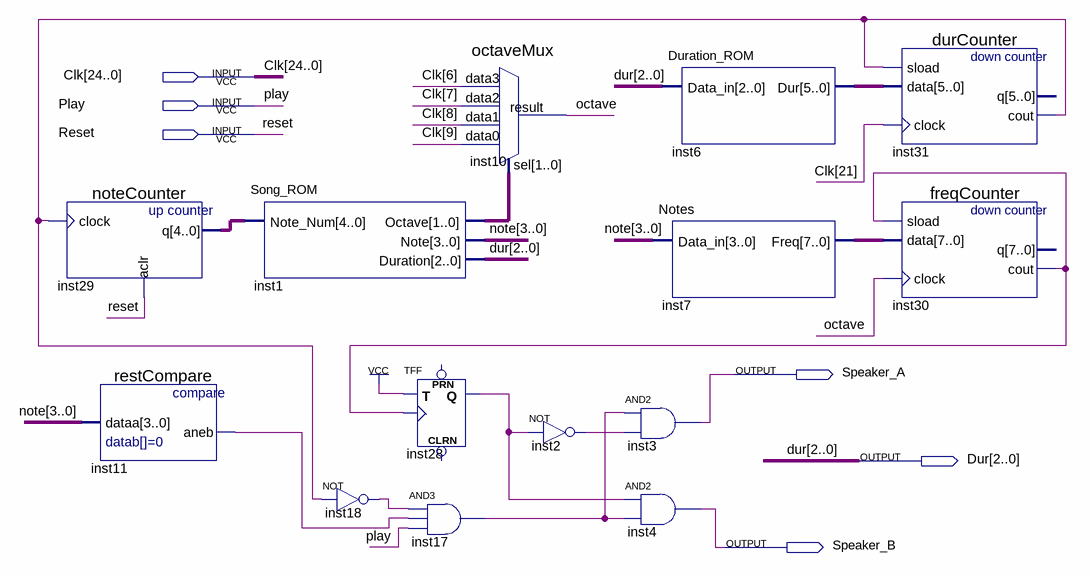
[diagram p0: schematic sheet]
// Quartus schematic Music_Block.bdf as structural Verilog: 14 symbols, 6 pins
module Music_Block (
  input  [24:0] Clk,
  input  Play,
  input  Reset,
  output Speaker_A,
  output [2:0] Dur,
  output Speaker_B
);

  wire inst2_out, inst11_aneb, inst17_out, inst18_out, inst28_q, inst30_cout, inst31_cout, octave;
  wire [1:0] inst1_octave;
  wire [3:0] note;
  wire [4:0] inst29_q;
  wire [5:0] inst6_dur;
  wire [7:0] inst7_freq;

  noteCounter inst29 (.clock(inst31_cout), .aclr(Reset), .q(inst29_q));
  restCompare inst11 (.dataa(note), .aneb(inst11_aneb));
  Song_ROM inst1 (.Note_Num(inst29_q), .Octave(inst1_octave), .Note(note), .Duration(Dur));
  not inst18 (inst18_out, inst31_cout);
  TFF inst28 (.T(1'b1), .CLK(inst30_cout), .Q(inst28_q));  // open: PRN, CLRN
  and inst17 (inst17_out, inst18_out, inst11_aneb, Play);
  octaveMux inst10 (
    .data3(Clk[6]), .data2(Clk[7]), .data1(Clk[8]), .data0(Clk[9]), .sel(inst1_octave), .result(octave));
  not inst2 (inst2_out, inst28_q);
  Duration_ROM inst6 (.Data_in(Dur), .Dur(inst6_dur));
  Notes inst7 (.Data_in(note), .Freq(inst7_freq));
  and inst3 (Speaker_A, inst17_out, inst2_out);
  and inst4 (Speaker_B, inst28_q, inst17_out);
  durCounter inst31 (.sload(inst31_cout), .data(inst6_dur), .clock(Clk[21]), .cout(inst31_cout));  // open: q
  freqCounter inst30 (.sload(inst30_cout), .data(inst7_freq), .clock(octave), .cout(inst30_cout));  // open: q
endmodule
